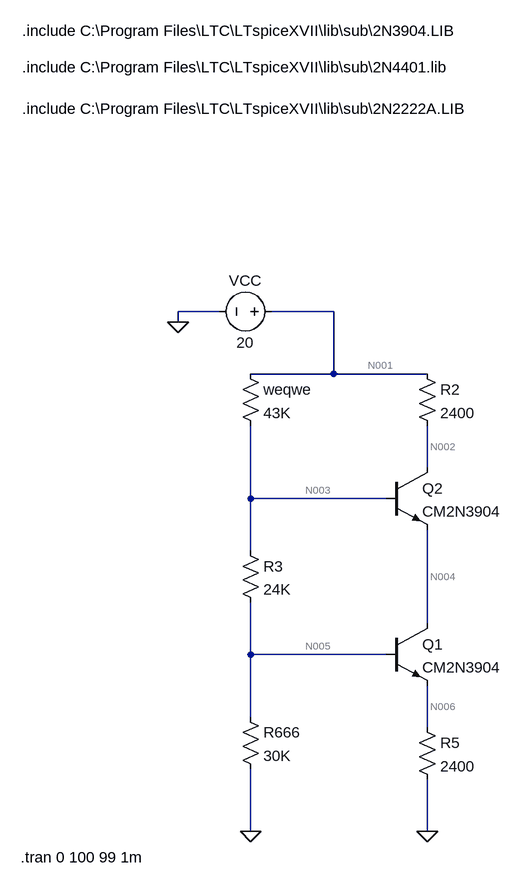
[diagram p0: schematic Cascode DC model.asc]
Cascode DC model.asc, the LTspice schematic file:
Version 4
SHEET 1 1036 980
WIRE -32 112 -96 112
WIRE 144 112 48 112
WIRE -96 128 -96 112
WIRE 144 208 144 112
WIRE 144 208 16 208
WIRE 288 208 144 208
WIRE 288 352 288 288
WIRE 16 400 16 288
WIRE 224 400 16 400
WIRE 16 480 16 400
WIRE 288 592 288 448
WIRE 16 640 16 560
WIRE 224 640 16 640
WIRE 16 736 16 640
WIRE 288 752 288 688
WIRE 16 912 16 816
WIRE 288 912 288 832
FLAG -96 128 0
FLAG 288 912 0
FLAG 16 912 0
SYMBOL npn 224 592 R0
SYMATTR InstName Q1
SYMATTR Value CM2N3904
SYMBOL npn 224 352 R0
SYMATTR InstName Q2
SYMATTR Value CM2N3904
SYMBOL res 272 192 R0
SYMATTR InstName R2
SYMATTR Value 2400
SYMBOL res 0 192 R0
SYMATTR InstName weqwe
SYMATTR Value 43K
SYMBOL voltage 64 112 R90
WINDOW 0 -32 56 VBottom 2
WINDOW 3 32 56 VTop 2
WINDOW 123 0 0 Left 0
WINDOW 39 0 0 Left 0
SYMATTR InstName VCC
SYMATTR Value 20
SYMBOL res 0 464 R0
SYMATTR InstName R3
SYMATTR Value 24K
SYMBOL res 272 736 R0
SYMATTR InstName R5
SYMATTR Value 2400
SYMBOL res 0 720 R0
SYMATTR InstName R666
SYMATTR Value 30K
TEXT -336 -200 Left 2 !.include C:\\Program Files\\LTC\\LTspiceXVII\\lib\\sub\\2N2222A.LIB
TEXT -336 -264 Left 2 !.include C:\\Program Files\\LTC\\LTspiceXVII\\lib\\sub\\2N4401.lib
TEXT -336 -320 Left 2 !.include C:\\Program Files\\LTC\\LTspiceXVII\\lib\\sub\\2N3904.LIB
TEXT -338 952 Left 2 !.tran 0 100 99 1m

The netlist it stands for:
* Cascode DC model.asc
Q1 N004 N005 N006 0 CM2N3904
Q2 N002 N003 N004 0 CM2N3904
R2 N001 N002 2400
R§weqwe N001 N003 43K
VCC N001 0 20
R3 N003 N005 24K
R5 N006 0 2400
R666 N005 0 30K
.model NPN NPN
.model PNP PNP
.lib standard.bjt
.include C:\Program Files\LTC\LTspiceXVII\lib\sub\2N2222A.LIB
.include C:\Program Files\LTC\LTspiceXVII\lib\sub\2N4401.lib
.include C:\Program Files\LTC\LTspiceXVII\lib\sub\2N3904.LIB
.tran 0 100 99 1m
.backanno
.end

* Results of the author's LTspice run, read from the files saved beside the schematic
* Operating Point, zero values left out:
*   V(n004) = 9.888 V
*   V(n005) = 5.654 V
*   V(n006) = 4.988 V
*   V(n002) = 15.09 V
*   V(n003) = 10.55 V
*   V(n001) = 20 V
*   Ic(Q2) = 2.047 mA
*   Ib(Q2) = 15.54 µA
*   Ie(Q2) = -2.063 mA
*   Ic(Q1) = 2.063 mA
*   Ib(Q1) = 15.68 µA
*   Ie(Q1) = -2.078 mA
*   I(R666) = 188.5 µA
*   I(R5) = 2.078 mA
*   I(R3) = 204.1 µA
*   I(Weqwe) = 219.7 µA
*   I(R2) = 2.047 mA
*   I(Vcc) = -2.267 mA